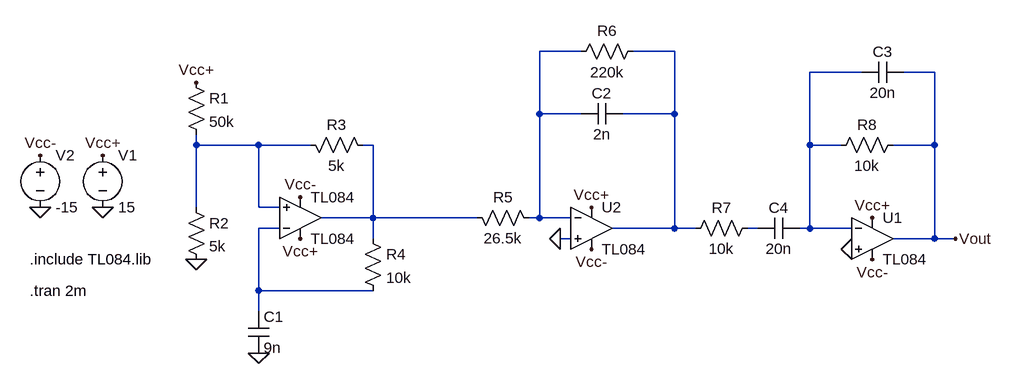
[diagram p0: schematic emmeteur_passe_bande.asc]
emmeteur_passe_bande.asc, the LTspice schematic file:
Version 4
SHEET 1 1208 680
WIRE 560 -32 496 -32
WIRE 704 -32 640 -32
WIRE 992 0 912 0
WIRE 1104 0 1056 0
WIRE 496 64 496 -32
WIRE 560 64 496 64
WIRE 704 64 704 -32
WIRE 704 64 624 64
WIRE -32 112 -32 96
WIRE 64 112 -32 112
WIRE 144 112 64 112
WIRE 240 112 224 112
WIRE 912 112 912 0
WIRE 960 112 912 112
WIRE 1104 112 1104 0
WIRE 1104 112 1040 112
WIRE -32 208 -32 112
WIRE 64 208 64 112
WIRE 96 208 64 208
WIRE 240 224 240 112
WIRE 240 224 160 224
WIRE 400 224 240 224
WIRE 496 224 496 64
WIRE 496 224 480 224
WIRE 544 224 496 224
WIRE 96 240 64 240
WIRE 704 240 704 64
WIRE 704 240 608 240
WIRE 736 240 704 240
WIRE 832 240 816 240
WIRE 912 240 912 112
WIRE 912 240 896 240
WIRE 976 240 912 240
WIRE 240 256 240 224
WIRE 544 256 528 256
WIRE 1104 256 1104 112
WIRE 1104 256 1040 256
WIRE 1136 256 1104 256
WIRE 64 336 64 240
WIRE 240 336 64 336
WIRE 64 368 64 336
FLAG -176 128 Vcc+
FLAG -272 128 Vcc-
FLAG 64 432 0
FLAG -32 288 0
FLAG -32 16 Vcc+
FLAG -272 208 0
FLAG -176 208 0
FLAG 128 192 Vcc-
FLAG 128 256 Vcc+
FLAG 528 256 0
FLAG 576 208 Vcc+
FLAG 576 272 Vcc-
FLAG 976 272 0
FLAG 1008 224 Vcc+
FLAG 1008 288 Vcc-
FLAG 1136 256 Vout
SYMBOL res -48 0 R0
SYMATTR InstName R1
SYMATTR Value 50k
SYMBOL res -48 192 R0
SYMATTR InstName R2
SYMATTR Value 5k
SYMBOL res 128 96 M90
WINDOW 0 0 56 VBottom 2
WINDOW 3 32 56 VTop 2
SYMATTR InstName R3
SYMATTR Value 5k
SYMBOL opamp2 128 288 M180
SYMATTR InstName TL084
SYMATTR Value TL084
SYMBOL res 224 240 R0
SYMATTR InstName R4
SYMATTR Value 10k
SYMBOL cap 48 368 R0
SYMATTR InstName C1
SYMATTR Value 9n
SYMBOL voltage -176 112 R0
WINDOW 123 0 0 Left 0
WINDOW 39 0 0 Left 0
SYMATTR InstName V1
SYMATTR Value 15
SYMBOL voltage -272 112 R0
WINDOW 123 0 0 Left 0
WINDOW 39 0 0 Left 0
SYMATTR InstName V2
SYMATTR Value -15
SYMBOL res 384 208 M90
WINDOW 0 0 56 VBottom 2
WINDOW 3 32 56 VTop 2
SYMATTR InstName R5
SYMATTR Value 26.5k
SYMBOL opamp2 576 176 R0
SYMATTR InstName U2
SYMATTR Value TL084
SYMBOL cap 624 48 R90
WINDOW 0 0 32 VBottom 2
WINDOW 3 32 32 VTop 2
SYMATTR InstName C2
SYMATTR Value 2n
SYMBOL res 656 -48 R90
WINDOW 0 0 56 VBottom 2
WINDOW 3 32 56 VTop 2
SYMATTR InstName R6
SYMATTR Value 220k
SYMBOL opamp2 1008 192 R0
SYMATTR InstName U1
SYMATTR Value TL084
SYMBOL res 832 224 R90
WINDOW 0 0 56 VBottom 2
WINDOW 3 32 56 VTop 2
SYMATTR InstName R7
SYMATTR Value 10k
SYMBOL cap 896 224 R90
WINDOW 0 0 32 VBottom 2
WINDOW 3 32 32 VTop 2
SYMATTR InstName C4
SYMATTR Value 20n
SYMBOL res 1056 96 R90
WINDOW 0 0 56 VBottom 2
WINDOW 3 32 56 VTop 2
SYMATTR InstName R8
SYMATTR Value 10k
SYMBOL cap 1056 -16 R90
WINDOW 0 0 32 VBottom 2
WINDOW 3 32 32 VTop 2
SYMATTR InstName C3
SYMATTR Value 20n
TEXT -288 288 Left 2 !.include TL084.lib
TEXT -288 336 Left 2 !.tran 2m

The netlist it stands for:
* emmeteur_passe_bande.asc
R1 Vcc+ N004 50k
R2 N004 0 5k
R3 N004 N005 5k
XTL084 N004 N006 Vcc+ Vcc- N005 TL084  ; pins In+ In- V+ V- OUT
R4 N005 N006 10k
C1 N006 0 9n
V1 Vcc+ 0 15
V2 Vcc- 0 -15
R5 N005 N001 26.5k
XU2 0 N001 Vcc+ Vcc- N002 TL084  ; pins In+ In- V+ V- OUT
C2 N002 N001 2n
R6 N002 N001 220k
XU1 0 N003 Vcc+ Vcc- Vout TL084  ; pins In+ In- V+ V- OUT
R7 N007 N002 10k
C4 N003 N007 20n
R8 Vout N003 10k
C3 Vout N003 20n
.include TL084.lib
.tran 2m
.backanno
.end